# Altium schematic sheet 海关全向控制器主控板电路V2_USB-GL850A.SchDoc
size A4
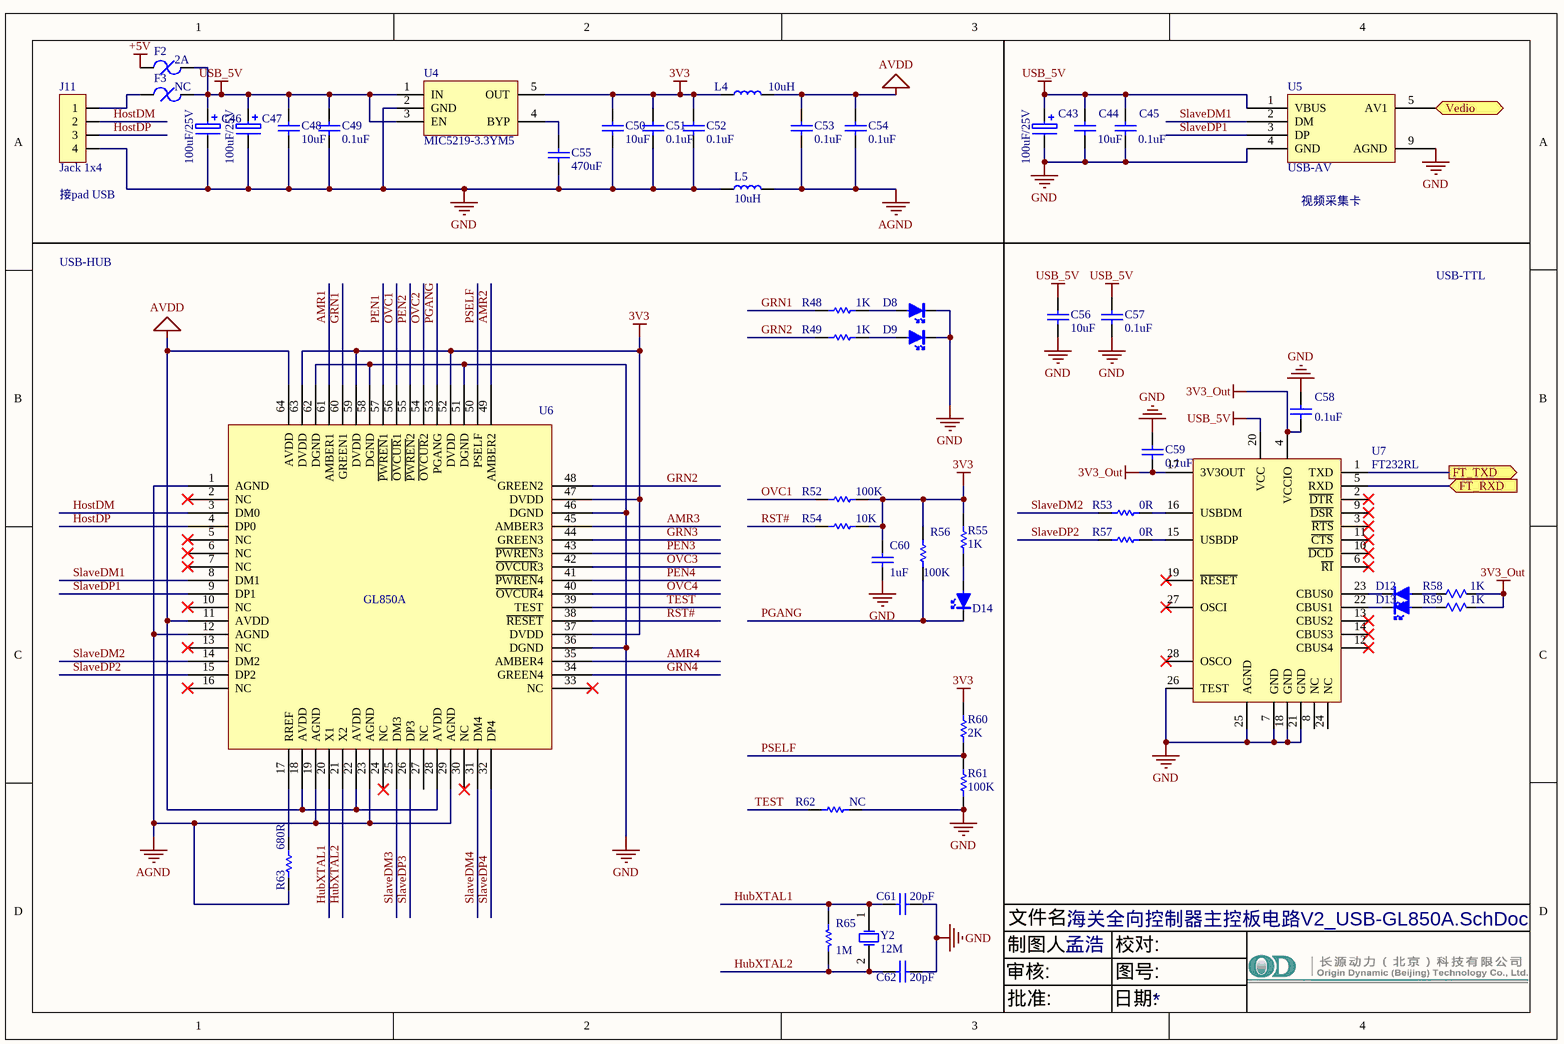
[diagram p0: 海关全向控制器主控板电路V2_USB-GL850A.SchDoc]

## Parts
C43  100uF/25V  [C7343]
C44  10uF  [C0603]
C45  0.1uF  [C0603]
C46  100uF/25V  [C7343]
C47  100uF/25V  [C7343]
C48  10uF  [C0603]
C49  0.1uF  [C0603]
C50  10uF  [C0603]
C51  0.1uF  [C0603]
C52  0.1uF  [C0603]
C53  0.1uF  [C0603]
C54  0.1uF  [C0603]
C55  470uF  [C0603]
C56  10uF  [C0603]
C57  0.1uF  [C0603]
C58  0.1uF  [C0603]
C59  0.1uF  [C0603]
C60  1uF  [C0603]
C61  20pF  [C0603]
C62  20pF  [C0603]
D8  LED  [LED0603]  (value not drawn)
D9  LED  [LED0603]  (value not drawn)
D12  LED  [LED0603]  (value not drawn)
D13  LED  [LED0603]  (value not drawn)
D14  LED  [LED0603]  (value not drawn)
F2  2A  [F1218]
F3  NC  [F1218]
J11  Jack 1x4  [ZH1.5-4AWD]
L4  10uH  [L0805]
L5  10uH  [L0805]
R48  1K  [R0603]
R49  1K  [R0603]
R52  100K  [R0603]
R53  0R  [R0603]
R54  10K  [R0603]
R55  1K  [R0603]
R56  100K  [R0603]
R57  0R  [R0603]
R58  1K  [R0603]
R59  1K  [R0603]
R60  2K  [R0603]
R61  100K  [R0603]
R62  NC  [R0603]
R63  680R  [R0603]
R65  1M  [R0603]
U4  MIC5219-3.3YM5  [SOT-23-5]
U5  USB-AV  [USB-AV]
U6  GL850A  [LQF64]
U7  FT232RL  [SSOP-28]
Y2  12M  [HC49S]

## Ports
FT_RXD (in), FT_TXD (out), Vedio (in)

## Nets
3V3: C50.1 C51.2 C52.2 C60.2 L4.1 R52.2 R54.2 R55.1 R56.2 R60.2 U4.5(OUT) U6.37(DVDD) U6.47(DVDD) U6.52(DVDD) U6.59(DVDD) U6.63(DVDD)
3V3_Out: C58.2 C59.1 R58.1 R59.1 U7.4(VCCIO) U7.17(3V3OUT)
+5V: F2.1
AGND: C53.1 C54.1 L5.2 R63.1 U6.1(AGND) U6.12(AGND) U6.19(AGND) U6.23(AGND) U6.29(AGND)
AVDD: C53.2 C54.2 L4.2 U6.11(AVDD) U6.18(AVDD) U6.22(AVDD) U6.28(AVDD) U6.64(AVDD)
GND: C43.2 C44.2 C45.1 C46.2 C47.2 C48.2 C49.1 C50.2 C51.1 C52.1 C55.1 C56.2 C57.1 C58.1 C59.2 C60.1 C61.2 C62.2 D8.2(K) D9.2(K) J11.4 L5.1 R61.1 R62.2 U4.2(GND) U5.4(GND) U5.9(AGND) U6.36(DGND) U6.46(DGND) U6.51(DGND) U6.58(DGND) U6.62(DGND) U7.7(GND) U7.18(GND) U7.21(GND) U7.25(AGND) U7.26(TEST)
USB_5V: C43.1 C44.1 C45.2 C46.1 C47.1 C48.1 C49.2 C56.1 C57.2 F2.2 F3.2 U4.1(IN) U4.3(EN) U5.1(VBUS) U7.20(VCC)
AMR1: U6.61(AMBER1)
AMR2: U6.49(AMBER2)
AMR3: U6.45(AMBER3)
AMR4: U6.35(AMBER4)
FT_RXD: U7.5(RXD) ; port FT_RXD
FT_TXD: U7.1(TXD) ; port FT_TXD
GRN1: R48.1 U6.60(GREEN1)
GRN2: R49.1 U6.48(GREEN2)
GRN3: U6.44(GREEN3)
GRN4: U6.34(GREEN4)
HostDM: J11.2 U6.3(DM0)
HostDP: J11.3 U6.4(DP0)
HubXTAL1: C61.1 R65.2 U6.20(X1) Y2.1(OSC1)
HubXTAL2: C62.1 R65.1 U6.21(X2) Y2.2(OSC2)
OVC1: R52.1 U6.56(~{OVCUR}1)
OVC2: U6.54(~{OVCUR}2)
OVC3: U6.42(~{OVCUR}3)
OVC4: U6.40(~{OVCUR}4)
PEN1: U6.57(~{PWREN}1)
PEN2: U6.55(~{PWREN}2)
PEN3: U6.43(~{PWREN}3)
PEN4: U6.41(~{PWREN}4)
PGANG: D14.2(K) R56.1 U6.53(PGANG)
PSELF: R60.1 R61.2 U6.50(PSELF)
RST#: R54.1 U6.38(~{RESET})
SlaveDM1: U5.2(DM) U6.8(DM1)
SlaveDM2: R53.1 U6.14(DM2)
SlaveDM3: U6.25(DM3)
SlaveDM4: U6.31(DM4)
SlaveDP1: U5.3(DP) U6.9(DP1)
SlaveDP2: R57.1 U6.15(DP2)
SlaveDP3: U6.26(DP3)
SlaveDP4: U6.32(DP4)
TEST: R62.1 U6.39(TEST)
Vedio: U5.5(AV1) ; port Vedio
NetC55_2: C55.2 U4.4(BYP)
NetD8_1: D8.1(A) R48.2
NetD9_1: D9.1(A) R49.2
NetD12_1: D12.1(A) R58.2
NetD12_2: D12.2(K) U7.23(CBUS0)
NetD13_1: D13.1(A) R59.2
NetD13_2: D13.2(K) U7.22(CBUS1)
NetD14_1: D14.1(A) R55.2
NetF3_1: F3.1 J11.1
NetR53_2: R53.2 U7.16(USBDM)
NetR57_2: R57.2 U7.15(USBDP)
NetR63_2: R63.2 U6.17(RREF)

Not connected (* = marked no-connect by the designer): U6 2(NC)* 5(NC)* 6(NC)* 7(NC)* 10(NC)* 13(NC)* 16(NC)* 24(NC)* 27(NC) 30(NC)* 33(NC)*; U7 2(~{DTR})* 3(~{RTS})* 6(~{RI})* 8(NC) 9(~{DSR})* 10(~{DCD})* 11(~{CTS})* 12(CBUS4)* 13(CBUS2)* 14(CBUS3)* 19(~{RESET})* 24(NC) 27(OSCI)* 28(OSCO)*

## Notes on the sheet
- (near J11) 接pad USB
- (near U5) 视频采集卡
- USB-HUB
- USB-TTL
- 文件名:
- 审核:
- 制图人:
- 孟浩
- 校对:
- 图号:
- 批准:
- 日期:

## Library data of the parts
C43 C46 C47 = Cap Poll
C44 C48 C50 C56 = CAP: Published: 8-Jun-2000; LatestRevisionDate: 17-Jul-2002; LatestRevisionNote: Re-released for DXP Platform.; PackageReference: RAD-0.3; Publisher: Altium Limited; Value: 10uF
C45 C49 C51-C55 C57 C59-C62 = Cap Semi
C58 = Cap: Capacitor; Value: 22pF; Published: 8-Jun-2000; Revision: July-2002: Re-released for DXP Platform.; Publisher: Altium Limited
F2 F3 = Fuse2
J11 = Jack 1x4: 插座
L4 L5 = Inductor
R48 R49 R52-R57 R60-R63 R65 = Res
R58 R59 = Res: Resistor; Published: 8-Jun-2000; LatestRevisionDate: 04-Mar-2005; LatestRevisionNote: PCB Footprint replaced.; PackageReference: J1-0603; Publisher: Altium Limited; Value: 1K
U4 = MIC5205
Y2 = XTAL: Crystal Oscillator; Published: 8-Jun-2000; LatestRevisionDate: 17-Jul-2002; LatestRevisionNote: Re-released for DXP Platform.; PackageReference: R38; Publisher: Altium Limited; PackageDescription: Crystal, Thru-Hole; 2 Leads; Body 3.1 x 8.2 mm (Dia.xH)